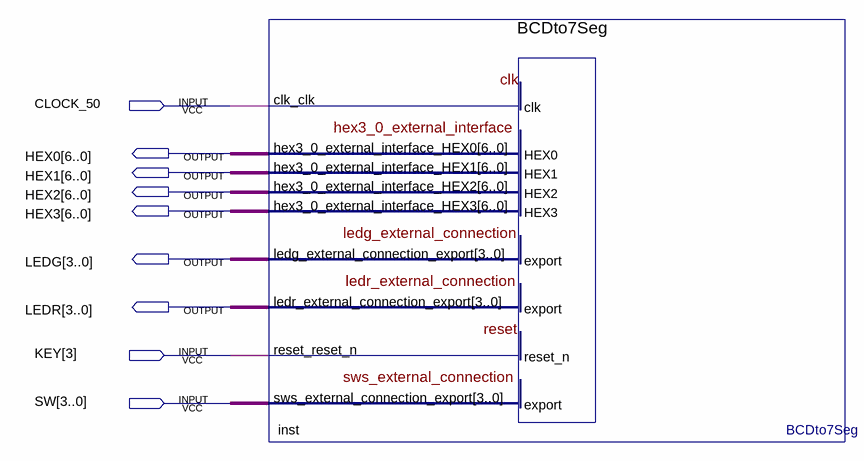
[diagram p0: schematic sheet]
// Quartus schematic TestBCDto7Seg.bdf as structural Verilog: 1 symbols, 9 pins
module TestBCDto7Seg (
  input  CLOCK_50,
  input  [3:3] KEY,
  input  [3:0] SW,
  output [6:0] HEX0,
  output [6:0] HEX1,
  output [6:0] HEX2,
  output [6:0] HEX3,
  output [3:0] LEDG,
  output [3:0] LEDR
);

  BCDto7Seg inst (
    .clk_clk(CLOCK_50), .reset_reset_n(KEY[3]), .sws_external_connection_export(SW),
    .hex3_0_external_interface_HEX0(HEX0), .hex3_0_external_interface_HEX1(HEX1),
    .hex3_0_external_interface_HEX2(HEX2), .hex3_0_external_interface_HEX3(HEX3),
    .ledg_external_connection_export(LEDG), .ledr_external_connection_export(LEDR));
endmodule
